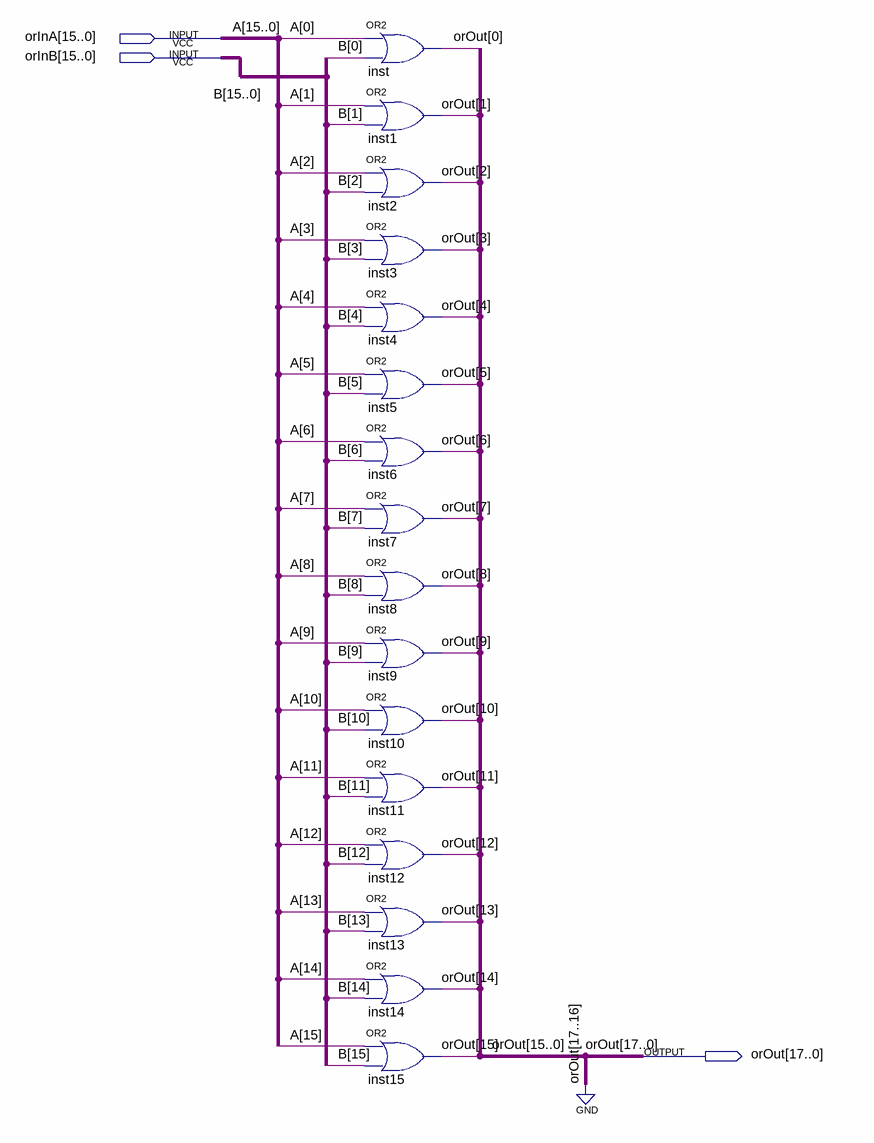
[diagram p0: schematic sheet]
// Quartus schematic or1616.bdf as structural Verilog: 16 symbols, 3 pins
module or1616 (
  input  [15:0] orInA,
  input  [15:0] orInB,
  output [17:0] orOut
);

  or inst (orOut[0], orInA[0], orInB[0]);
  or inst1 (orOut[1], orInA[1], orInB[1]);
  or inst2 (orOut[2], orInA[2], orInB[2]);
  or inst3 (orOut[3], orInA[3], orInB[3]);
  or inst4 (orOut[4], orInA[4], orInB[4]);
  or inst5 (orOut[5], orInA[5], orInB[5]);
  or inst6 (orOut[6], orInA[6], orInB[6]);
  or inst7 (orOut[7], orInA[7], orInB[7]);
  or inst8 (orOut[8], orInA[8], orInB[8]);
  or inst9 (orOut[9], orInA[9], orInB[9]);
  or inst10 (orOut[10], orInA[10], orInB[10]);
  or inst11 (orOut[11], orInA[11], orInB[11]);
  or inst12 (orOut[12], orInA[12], orInB[12]);
  or inst13 (orOut[13], orInA[13], orInB[13]);
  or inst14 (orOut[14], orInA[14], orInB[14]);
  or inst15 (orOut[15], orInA[15], orInB[15]);

  assign orOut[17:16] = 2'b00;

  // Other names for the same wires on the sheet: A[15:0] = orInA; B[15:0] = orInB
endmodule
